# EAGLE design miniProIR (EAGLE 9.6.1)
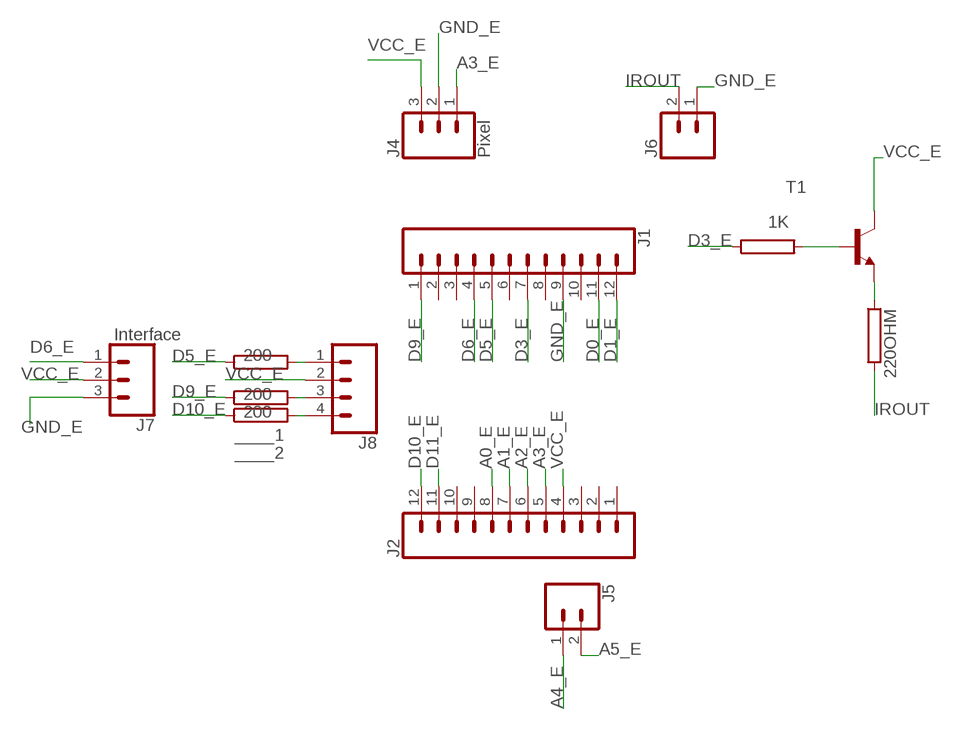
[diagram p0: schematic, sheet 1]

## Parts
1K  RCA0001  [CA0001]
200  RCA0001  [CA0001]
220OHM  RCA0001  [CA0001]
____1  200  RCA0001  [CA0001]
____2  200  RCA0001  [CA0001]
J1  CONN_12  [1X12]
J2  CONN_12  [1X12]
J4  Pixel  CONN_03  [1X03]
J5  CONN_02  [1X02]
J6  CONN_02  [1X02]
J7  Interface  CONN_03  [1X03]
J8  CONN_04  [1X04]
T1  29-NPN-TO92-EBC  [TO92-EBC]

## Nets
A0_E: J2.8
A1_E: J2.7
A2_E: J2.6
A3_E: J2.5 J4.1
A4_E: J5.1
A5_E: J5.2
D0_E: J1.11
D1_E: J1.12
D3_E: 1K.1 J1.7
D5_E: 200.1 J1.5
D6_E: J1.4 J7.1
D9_E: ____1.1 J1.1
D10_E: ____2.1 J2.12
D11_E: J2.11
GND_E: J1.9 J4.2 J6.1 J7.3
IROUT: 220OHM.2 J6.2
N$1: 220OHM.1 T1.E
N$2: 1K.2 T1.B
N$3: 200.2 J8.1
N$4: ____1.2 J8.3
N$5: ____2.2 J8.4
VCC_E: J2.4 J4.3 J7.2 J8.2 T1.C
Unconnected: J1.2 J1.3 J1.6 J1.8 J1.10 J2.1 J2.2 J2.3 J2.9 J2.10

## Library data of the parts
1K 200 220OHM ____1 ____2 = resistor-power:R: Power Resitor; OC_FARNELL: unknown; OC_NEWARK: unknown
J1 J2 = SparkFun-Connectors:CONN_12: Multi connection point. Often used as Generic Header-pin footprint for 0.1 inch spaced/style header connections On any of the 0.1 inch spaced packages, you can populate with these: Break Away Headers - Straight <https://www.sparkfun.com/products/116> (PRT-00116) Break Away Male Headers - Right Angle <https://www.sparkfun.com/products/553> (PRT-00553) Female Headers <https://www.sparkfun.com/products/115> (PRT-00115) Break Away Headers - Machine Pin <https://www.sparkfun.com/products/117> (PRT-00117) Break Away Female Headers - Swiss Machine Pin <https://www.sparkfun.com/products/743> (PRT-00743) For SCREWTERMINALS and SPRING TERMINALS visit here: Screw Terimnals on SparkFun.com <https://www.sparkfun.com/search/results?term=Screw+Terminals> (5mm/3.5mm/2.54mm spacing) This device is also useful as a general connection point to wire up your design to another part of your project. Our various solder wires solder well into these plated through hole pads. Hook-Up Wire - Assortment (Stranded, 22 AWG) <https://www.sparkfun.com/products/11375> (PRT-11375) Hook-Up Wire - Assortment (Solid Core, 22 AWG) <https://www.sparkfun.com/products/11367> (PRT-11367) View the entire wire category on our website here <https://www.sparkfun.com/categories/141> Special notes: Molex polarized connector foot print use with SKU : PRT-08231 with associated crimp pins and housings. 1MM SMD Version SKU: PRT-10208 NOTES ON THE VARIANTS LOCK and LOCK_LONGPADS... This footprint was designed to help hold the alignment of a through-hole component (i.e. 6-pin header) while soldering it into place. You may notice that each hole has been shifted either up or down by 0.005 of an inch from it's more standard position (which is a perfectly straight line). This slight alteration caused the pins (the squares in the middle) to touch the edges of the holes. Because they are alternating, it causes a "brace" to hold the component in place. 0.005 has proven to be the perfect amount of "off-center" position when using our standard breakaway headers. Although looks a little odd when you look at the bare footprint, once you have a header in there, the alteration is very hard to notice. Also,if you push a header all the way into place, it is covered up entirely on the bottom side.
J4 J7 = SparkFun-Connectors:CONN_03: Multi connection point. Often used as Generic Header-pin footprint for 0.1 inch spaced/style header connections On any of the 0.1 inch spaced packages, you can populate with these: Break Away Headers - Straight <https://www.sparkfun.com/products/116> (PRT-00116) Break Away Male Headers - Right Angle <https://www.sparkfun.com/products/553> (PRT-00553) Female Headers <https://www.sparkfun.com/products/115> (PRT-00115) Break Away Headers - Machine Pin <https://www.sparkfun.com/products/117> (PRT-00117) Break Away Female Headers - Swiss Machine Pin <https://www.sparkfun.com/products/743> (PRT-00743) Stackable Header - 3 Pin (Female, 0.1") <https://www.sparkfun.com/products/13875> (PRT-13875) For SCREWTERMINALS and SPRING TERMINALS visit here: Screw Terimnals on SparkFun.com <https://www.sparkfun.com/search/results?term=Screw+Terminals> (5mm/3.5mm/2.54mm spacing) This device is also useful as a general connection point to wire up your design to another part of your project. Our various solder wires solder well into these plated through hole pads. Hook-Up Wire - Assortment (Stranded, 22 AWG) <https://www.sparkfun.com/products/11375> (PRT-11375) Hook-Up Wire - Assortment (Solid Core, 22 AWG) <https://www.sparkfun.com/products/11367> (PRT-11367) View the entire wire category on our website here <https://www.sparkfun.com/categories/141> Special notes: Molex polarized connector foot print use with SKU : PRT-08232 with associated crimp pins and housings.; PROD_ID: XXX-00000; VALUE: 455-1750-1-ND
J5 J6 = SparkFun-Connectors:CONN_02: Multi connection point. Often used as Generic Header-pin footprint for 0.1 inch spaced/style header connections On any of the 0.1 inch spaced packages, you can populate with these: Break Away Headers - Straight <https://www.sparkfun.com/products/116> (PRT-00116) Break Away Male Headers - Right Angle <https://www.sparkfun.com/products/553> (PRT-00553) Female Headers <https://www.sparkfun.com/products/115> (PRT-00115) Break Away Headers - Machine Pin <https://www.sparkfun.com/products/117> (PRT-00117) Break Away Female Headers - Swiss Machine Pin <https://www.sparkfun.com/products/743> (PRT-00743) For SCREWTERMINALS and SPRING TERMINALS visit here: Screw Terimnals on SparkFun.com <https://www.sparkfun.com/search/results?term=Screw+Terminals> (5mm/3.5mm/2.54mm spacing) This device is also useful as a general connection point to wire up your design to another part of your project. Our various solder wires solder well into these plated through hole pads. Hook-Up Wire - Assortment (Stranded, 22 AWG) <https://www.sparkfun.com/products/11375> (PRT-11375) Hook-Up Wire - Assortment (Solid Core, 22 AWG) <https://www.sparkfun.com/products/11367> (PRT-11367) View the entire wire category on our website here <https://www.sparkfun.com/categories/141> Special notes: Molex polarized connector foot print use with: PRT-08233 with associated crimp pins and housings. 2.54_SCREWTERM for use with PRT-10571. 3.5mm Screw Terminal footprints for PRT-08084 5mm Screw Terminal footprints for use with PRT-08432
J8 = SparkFun-Connectors:CONN_04: Multi connection point. Often used as Generic Header-pin footprint for 0.1 inch spaced/style header connections On any of the 0.1 inch spaced packages, you can populate with these: Break Away Headers - Straight <https://www.sparkfun.com/products/116> (PRT-00116) Break Away Male Headers - Right Angle <https://www.sparkfun.com/products/553> (PRT-00553) Female Headers <https://www.sparkfun.com/products/115> (PRT-00115) Break Away Headers - Machine Pin <https://www.sparkfun.com/products/117> (PRT-00117) Break Away Female Headers - Swiss Machine Pin <https://www.sparkfun.com/products/743> (PRT-00743) For SCREWTERMINALS and SPRING TERMINALS visit here: Screw Terimnals on SparkFun.com <https://www.sparkfun.com/search/results?term=Screw+Terminals> (5mm/3.5mm/2.54mm spacing) This device is also useful as a general connection point to wire up your design to another part of your project. Our various solder wires solder well into these plated through hole pads. Hook-Up Wire - Assortment (Stranded, 22 AWG) <https://www.sparkfun.com/products/11375> (PRT-11375) Hook-Up Wire - Assortment (Solid Core, 22 AWG) <https://www.sparkfun.com/products/11367> (PRT-11367) View the entire wire category on our website here <https://www.sparkfun.com/categories/141> Special notes: Molex polarized connector foot print use with SKU : PRT-08231 with associated crimp pins and housings. 1MM SMD Version SKU: PRT-10208; PROD_ID: CONN-09696
T1 = transistor:*-NPN-: NPN Transistror BF959 corrected 2008.03.06

## Net classes
0 default: width 0.254 mm, clearance 0.254 mm
1 power: width 0.61 mm, drill 0.711 mm, clearance 0.33 mm
2 gnd: width 0.305 mm, drill 0.711 mm, clearance 0.254 mm
3 usbvcc: width 0.508 mm, drill 0.711 mm, clearance 0.254 mm
4 aref: width 0.406 mm

## Board
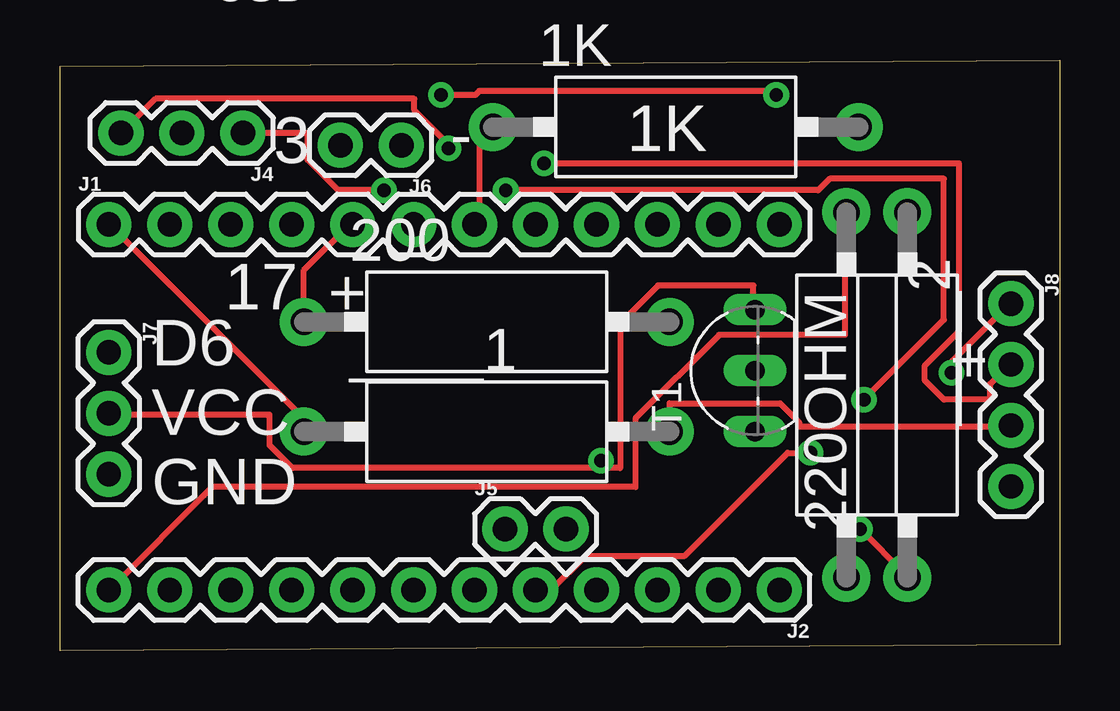
[diagram p1: board, top side]
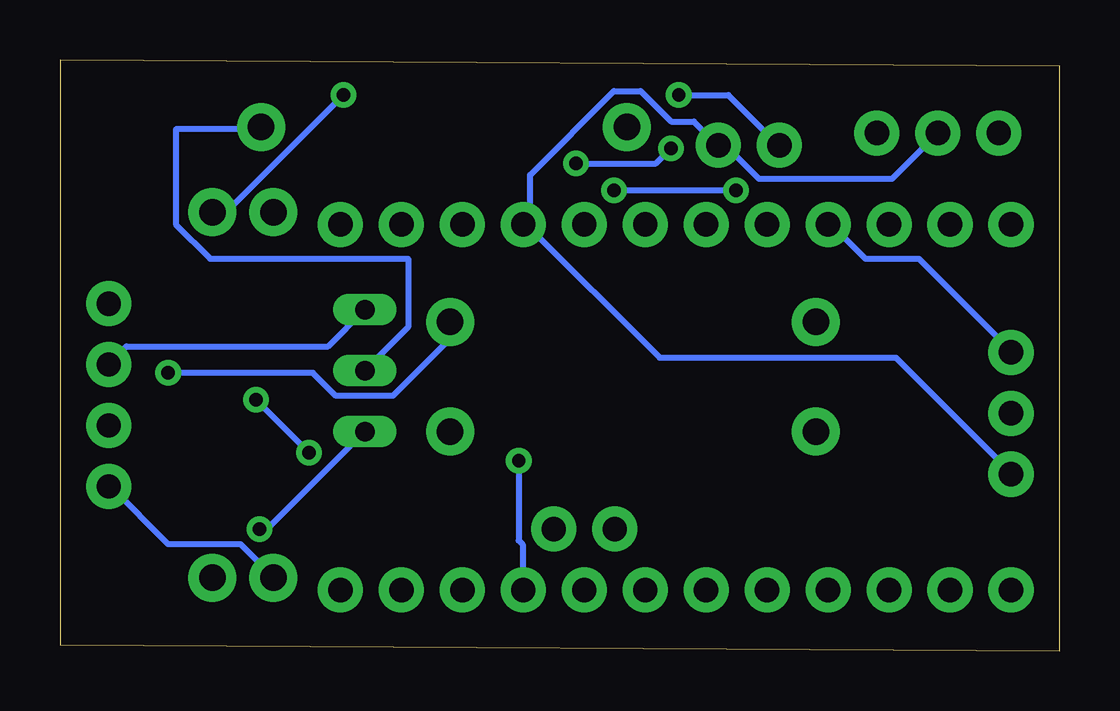
[diagram p2: board, bottom side, seen from below]

Size 41.66 x 24.64 mm. Coordinates in mm from the lower left corner, seen from the top.
Outline: 0,24.38 41.66,24.64 41.66,0.25 0,0 0,24.38
Copper layers (1*16): Top 0.035mm / dielectric 1.5mm / Bottom 0.035mm
Design rules "default": minimum track width 10mil, minimum drill 22mil, track to track 10mil, track to pad 10mil, pad to pad 10mil, via to via 16mil, smd to smd 8mil, copper to edge 30mil, drill to drill 12mil, minimum pad ring 10mil, minimum via ring 10mil, stop-mask expansion 4mil, vias tented up to drill 0mil, thermal gap 10mil
vRestrict: area 25.4,45.5 to 27.1,49.1; area 33.4,41 to 34.9,44.6; area 35.9,41 to 37.5,44.6; area 38.5,41 to 40,44.6; area 42.5,38.6 to 43.1,38.9

### Footprints (pad centres in the part's own frame; a part is rotated, then mirrored left to right if it is on the bottom)
CA0001 = drill 1.1 pad 2: 1 -7.62,0; 2 7.62,0
1X12 = drill 1.016 pad 1.88: 1 0,0; 2 2.54,0; 3 5.08,0; 4 7.62,0; 5 10.16,0; 6 12.7,0; 7 15.24,0; 8 17.78,0; 9 20.32,0; 10 22.86,0; 11 25.4,0; 12 27.94,0
1X03 = drill 1.016 pad 1.88: 1 0,0; 2 2.54,0; 3 5.08,0
1X02 = drill 1.016 pad 1.88: 1 0,0; 2 2.54,0
1X04 = drill 1.016 pad 1.88: 1 0,0; 2 2.54,0; 3 5.08,0; 4 7.62,0
TO92-EBC = drill 0.813 long: B 0,-1.27; C 2.54,-1.27; E -2.54,-1.27

### Placement (x,y rotation side)
1K  25.65,21.84 0 top
200  17.78,13.72 0 top
220OHM  35.31,10.67 90 top
____1  17.78,9.14 0 top
____2  32.77,10.67 270 top
J1  2.03,17.78 0 top
J2  29.97,2.54 180 top
J4  7.62,21.59 180 top
J5  18.54,5.08 0 top
J6  14.22,21.08 180 top
J7  2.03,12.45 270 top
J8  39.62,14.48 270 top
T1  27.69,11.68 90 top

### Tracks (layer width: path | path; a pad name or v marks a point on that pad's centre or on a via)
A3_E  (via drill 0.56)
  Top 0.254: J4.1 10.32,21.59 10.32,20.48 11.59,19.21 v13.49,19.21 | v18.57,19.21 31.59,19.21 32.07,19.68 36.83,19.68 36.83,13.81 v33.5,10.48 | v31.27,8.26 30.32,8.26 26.04,3.97 21.91,3.97 20.48,2.54 J2.5
  Bottom 0.254: v18.57,19.21 v13.49,19.21 | v31.27,8.26 v33.5,10.48
D3_E
  Top 0.254: 1K.1 17.46,21.27 17.46,17.94 17.3,17.78 J1.7
D5_E
  Top 0.254: 200.1 10.16,15.88 12.06,17.78 J1.5
D6_E
  Bottom 0.254: J7.1 2.06,12.54 5.87,16.35 8.1,16.35 9.53,17.78 J1.4
D9_E
  Top 0.254: ____1.1 10.16,9.68 2.06,17.78 J1.1
D10_E
  Top 0.254: J2.12 2.06,2.54 6.35,6.83 23.97,6.83 23.97,9.68 27.46,13.18 32.7,13.18 32.7,18.26 ____2.1
GND_E
  Bottom 0.254: J4.2 6.99,19.68 12.54,19.68 13.81,20.95 14.13,20.95 J6.1 14.29,21.11 15.24,22.07 16.19,22.07 17.46,23.34 18.57,23.34 22.07,19.84 22.07,17.78 J1.9 22.23,17.78 16.67,12.22 6.83,12.22 2.06,7.46 J7.3
IROUT  (via drill 0.56)
  Top 0.254: v15.88,23.18 17.3,23.18 17.46,23.34 29.84,23.34 v29.84,23.18
  Bottom 0.254: v15.88,23.18 13.81,23.18 11.75,21.11 J6.2 | v29.84,23.18 34.61,18.41 35.24,18.41 220OHM.2
N$1  (via drill 0.56)
  Top 0.254: v33.34,5.08 35.24,3.17 220OHM.1
  Bottom 0.254: T1.E 33.02,5.08 v33.34,5.08
N$2
  Bottom 0.254: T1.B 27.15,13.49 27.15,16.35 35.4,16.35 36.83,17.78 36.83,21.75 33.34,21.75 1K.2
N$3  (via drill 0.56)
  Top 0.254: v37.15,11.59 37.15,12.06 39.53,14.45 J8.1
  Bottom 0.254: v37.15,11.59 31.11,11.59 30.16,10.64 27.78,10.64 25.4,13.02 200.2
N$4
  Top 0.254: ____1.2 25.4,10.32 30,10.32 30.8,9.53 30.8,9.37 39.53,9.37 J8.3
N$5
  Bottom 0.254: J8.4 39.53,6.83 37.15,4.45 34.13,4.45 32.86,3.17 ____2.2
VCC_E  (via drill 0.56)
  Top 0.254: 22.54,7.62 23.34,7.62 23.34,13.65 24.92,15.24 28.89,15.24 28.89,14.29 T1.C | 22.54,7.62 9.68,7.62 8.73,8.57 8.73,9.84 2.06,9.84 J7.2 | J4.3 3.97,23.02 14.76,23.02 14.76,22.54 16.19,21.11 v16.19,20.95 | v20.16,20.32 37.47,20.32 37.47,13.34 36.04,11.91 36.04,11.27 36.83,10.48 38.73,10.48 38.73,11.11 39.53,11.91 J8.2 | 22.54,7.62 v22.54,7.94
  Bottom 0.254: T1.C 30.48,12.7 38.89,12.7 39.53,12.06 J8.2 | v16.19,20.95 16.83,20.32 v20.16,20.32 | v22.54,7.94 22.54,4.6 22.38,4.45 22.38,2.54 J2.4

### Text on the board
tNames: 3 2 1 0 9 8 | GND | 1 1 1 1 | AREF | PWM | PWM | PWM | USB
Reference: C8 | C2 | R11 | C4 | C5
_tsilk: - | 1K | 3 | 17 | + | + | D6 / VCC / GND